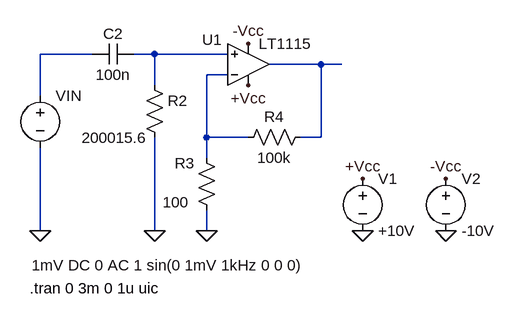
[diagram p0: schematic schema 1.6 Luca Fantin 2000156.asc]
schema 1.6 Luca Fantin 2000156.asc, the LTspice schematic file:
Version 4
SHEET 1 880 680
WIRE 112 -16 32 -16
WIRE 208 -16 176 -16
WIRE 320 -16 208 -16
WIRE 464 0 384 0
WIRE 496 0 464 0
WIRE 320 16 288 16
WIRE 208 32 208 -16
WIRE 32 48 32 -16
WIRE 288 112 288 16
WIRE 352 112 288 112
WIRE 464 112 464 0
WIRE 464 112 432 112
WIRE 288 144 288 112
WIRE 32 256 32 128
WIRE 208 256 208 112
WIRE 288 256 288 224
FLAG 32 256 0
FLAG 208 256 0
FLAG 288 256 0
FLAG 528 256 0
FLAG 656 256 0
FLAG 528 176 +Vcc
FLAG 352 32 +Vcc
FLAG 656 176 -Vcc
FLAG 352 -32 -Vcc
SYMBOL voltage 32 32 R0
WINDOW 3 -13 277 Left 2
WINDOW 123 24 72 Left 2
WINDOW 39 0 0 Left 0
SYMATTR Value 1mV DC 0 AC 1 sin(0 1mV 1kHz 0 0 0)
SYMATTR InstName VIN
SYMBOL cap 176 -32 R90
WINDOW 0 0 32 VBottom 2
WINDOW 3 32 32 VTop 2
SYMATTR InstName C2
SYMATTR Value 100n
SYMBOL res 192 16 R0
WINDOW 3 5 97 Right 2
SYMATTR Value 200015.6
SYMATTR InstName R2
SYMBOL res 272 128 R0
WINDOW 0 -33 24 Left 2
WINDOW 3 -52 84 Left 2
SYMATTR InstName R3
SYMATTR Value 100
SYMBOL res 448 96 R90
WINDOW 0 0 56 VBottom 2
WINDOW 3 32 56 VTop 2
SYMATTR InstName R4
SYMATTR Value 100k
SYMBOL OpAmps\\LT1115 352 64 M180
WINDOW 0 -71 102 Left 2
SYMATTR InstName U1
SYMBOL voltage 528 160 R0
SYMATTR InstName V1
SYMATTR Value +10V
SYMBOL voltage 656 160 R0
SYMATTR InstName V2
SYMATTR Value -10V
TEXT 16 344 Left 2 !.tran 0 3m 0 1u uic

The netlist it stands for:
* schema 1.6 Luca Fantin 2000156.asc
VIN N001 0 1mV DC 0 AC 1 sin(0 1mV 1kHz 0 0 0)
C2 N002 N001 100n
R2 N002 0 200015.6
R3 N004 0 100
R4 N003 N004 100k
XU1 N002 N004 +Vcc -Vcc N003 LT1028  ; LT1115, pins In+ In- V+ V- OUT
V1 +Vcc 0 +10V
V2 -Vcc 0 -10V
.tran 0 3m 0 1u uic
.lib LTC.lib
.backanno
.end

* Results of the author's LTspice run, read from the files saved beside the schematic
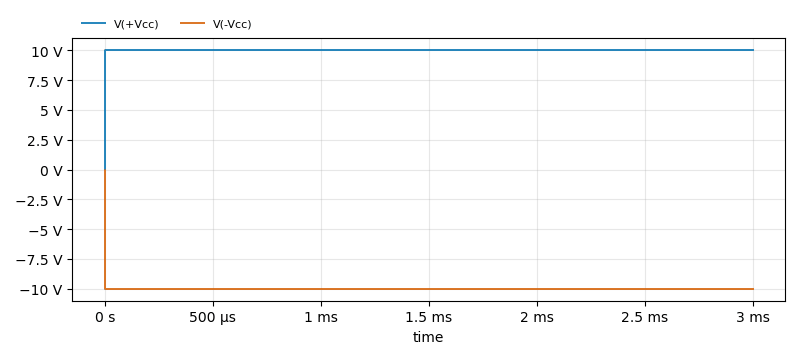
[diagram p1: Transient Analysis of schema 1.6 Luca Fantin 2000156.asc, plotted from the saved traces]
* Transient Analysis, 1 run:
*   V(+Vcc): min 0 V, max 10 V, average 10 V, rms 10 V, last 10 V
*   V(-Vcc): min -10 V, max 0 V, average -10 V, rms 10 V, last -10 V